# EAGLE design PARAMETRIK2L (EAGLE 7.4.0)
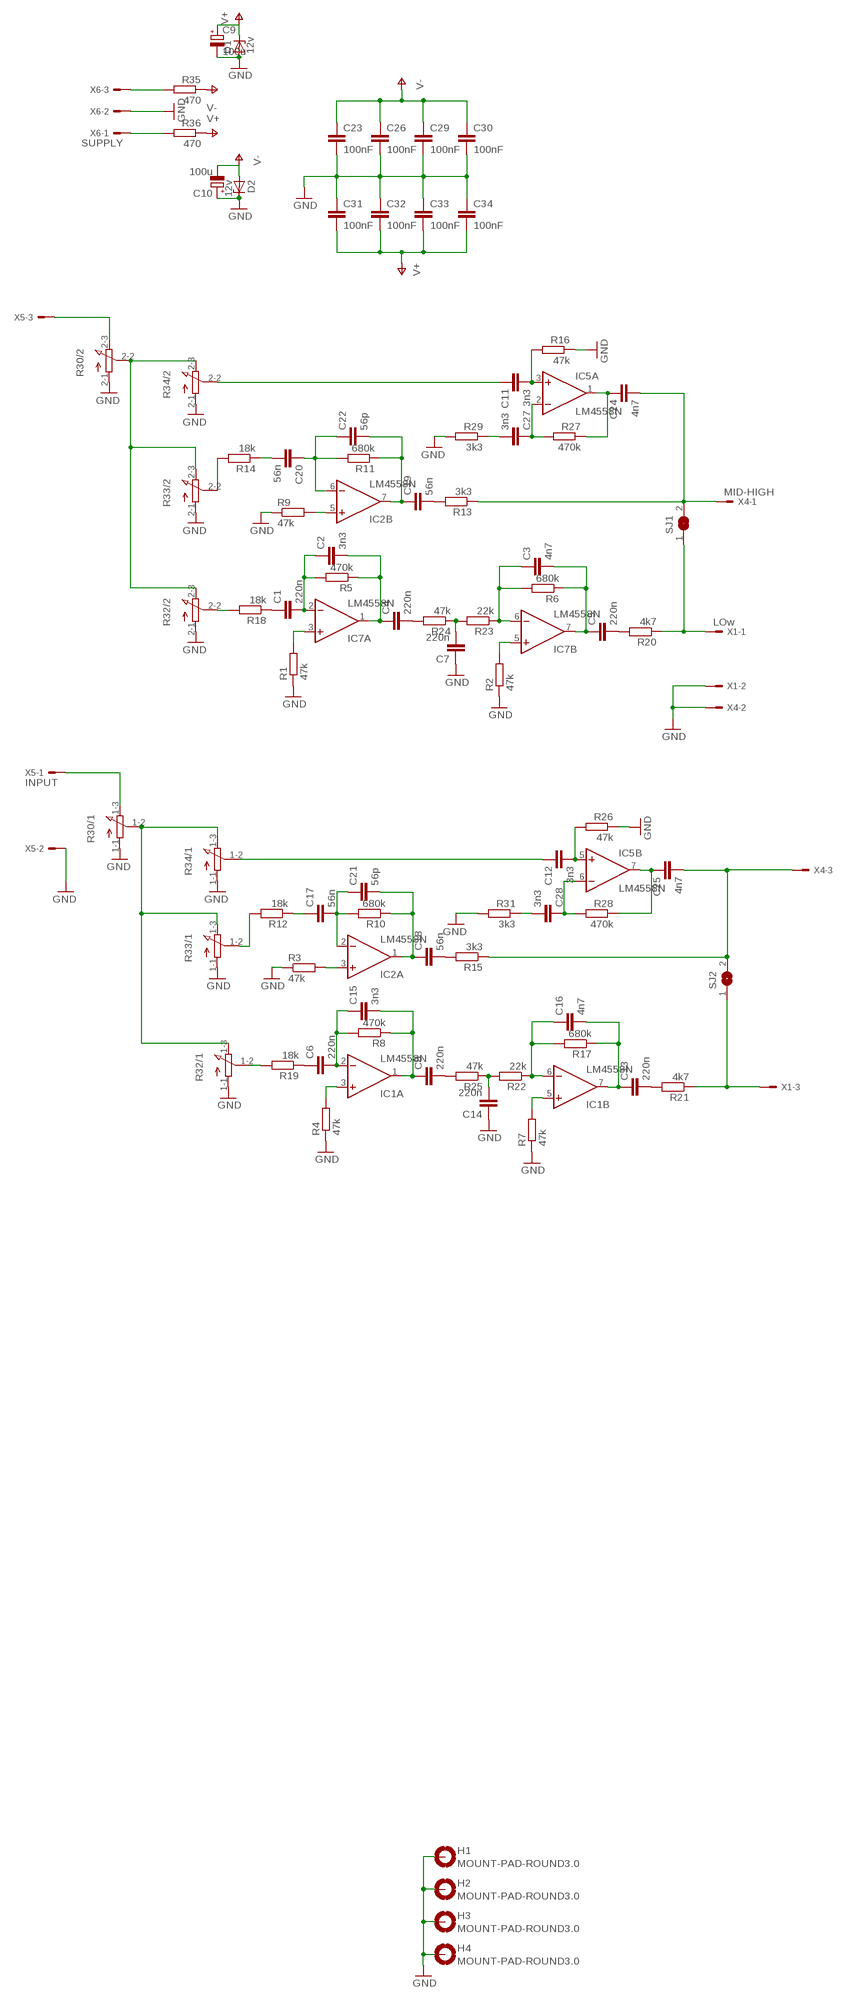
[diagram p0: schematic, sheet 1]

## Parts
C1  220n  C-EU050-030X075  [C050-030X075]
C2  3n3  C-EU025-024X044  [C025-024X044]
C3  4n7  C-EU025-024X044  [C025-024X044]
C4  220n  C-EU050-030X075  [C050-030X075]
C5  220n  C-EU050-030X075  [C050-030X075]
C6  220n  C-EU050-030X075  [C050-030X075]
C7  220n  C-EU050-030X075  [C050-030X075]
C8  220n  C-EU050-030X075  [C050-030X075]
C9  100u  CPOL-EUE2.5-6  [E2,5-6]
C10  100u  CPOL-EUE2.5-6  [E2,5-6]
C11  3n3  C-EU025-024X044  [C025-024X044]
C12  3n3  C-EU025-024X044  [C025-024X044]
C13  220n  C-EU050-030X075  [C050-030X075]
C14  220n  C-EU050-030X075  [C050-030X075]
C15  3n3  C-EU025-024X044  [C025-024X044]
C16  4n7  C-EU025-024X044  [C025-024X044]
C17  56n  C-EU050-030X075  [C050-030X075]
C18  56n  C-EU050-030X075  [C050-030X075]
C19  56n  C-EU050-030X075  [C050-030X075]
C20  56n  C-EU050-030X075  [C050-030X075]
C21  56p  C-EU025-024X044  [C025-024X044]
C22  56p  C-EU025-024X044  [C025-024X044]
C23  100nF  C-EU050-024X044  [C050-024X044]
C24  4n7  C-EU025-024X044  [C025-024X044]
C25  4n7  C-EU025-024X044  [C025-024X044]
C26  100nF  C-EU050-024X044  [C050-024X044]
C27  3n3  C-EU025-024X044  [C025-024X044]
C28  3n3  C-EU025-024X044  [C025-024X044]
C29  100nF  C-EU050-024X044  [C050-024X044]
C30  100nF  C-EU050-024X044  [C050-024X044]
C31  100nF  C-EU050-024X044  [C050-024X044]
C32  100nF  C-EU050-024X044  [C050-024X044]
C33  100nF  C-EU050-024X044  [C050-024X044]
C34  100nF  C-EU050-024X044  [C050-024X044]
D1  12v  1N821  [DO35Z10]
D2  12v  1N821  [DO35Z10]
H1  MOUNT-PAD-ROUND3.0  [3,0-PAD]
H2  MOUNT-PAD-ROUND3.0  [3,0-PAD]
H3  MOUNT-PAD-ROUND3.0  [3,0-PAD]
H4  MOUNT-PAD-ROUND3.0  [3,0-PAD]
IC1  LM4558N  [DIL08]
IC2  LM4558N  [DIL08]
IC5  LM4558N  [DIL08]
IC7  LM4558N  [DIL08]
R1  47k  R-EU_0207/2V  [0207/2V]
R2  47k  R-EU_0207/2V  [0207/2V]
R3  47k  R-EU_0207/2V  [0207/2V]
R4  47k  R-EU_0207/2V  [0207/2V]
R5  470k  R-EU_0207/2V  [0207/2V]
R6  680k  R-EU_0207/2V  [0207/2V]
R7  47k  R-EU_0207/2V  [0207/2V]
R8  470k  R-EU_0207/2V  [0207/2V]
R9  47k  R-EU_0207/2V  [0207/2V]
R10  680k  R-EU_0207/2V  [0207/2V]
R11  680k  R-EU_0207/2V  [0207/2V]
R12  18k  R-EU_0207/2V  [0207/2V]
R13  3k3  R-EU_0207/2V  [0207/2V]
R14  18k  R-EU_0207/2V  [0207/2V]
R15  3k3  R-EU_0207/2V  [0207/2V]
R16  47k  R-EU_0207/2V  [0207/2V]
R17  680k  R-EU_0207/2V  [0207/2V]
R18  18k  R-EU_0207/2V  [0207/2V]
R19  18k  R-EU_0207/2V  [0207/2V]
R20  4k7  R-EU_0207/2V  [0207/2V]
R21  4k7  R-EU_0207/2V  [0207/2V]
R22  22k  R-EU_0207/2V  [0207/2V]
R23  22k  R-EU_0207/2V  [0207/2V]
R24  47k  R-EU_0207/2V  [0207/2V]
R25  47k  R-EU_0207/2V  [0207/2V]
R26  47k  R-EU_0207/2V  [0207/2V]
R27  470k  R-EU_0207/2V  [0207/2V]
R28  470k  R-EU_0207/2V  [0207/2V]
R29  3k3  R-EU_0207/2V  [0207/2V]
R30  3RP/1610G  [3RP/1610G]
R31  3k3  R-EU_0207/2V  [0207/2V]
R32  3RP/1610G  [3RP/1610G]
R33  3RP/1610G  [3RP/1610G]
R34  3RP/1610G  [3RP/1610G]
R35  470  R-EU_0207/10  [0207/10]
R36  470  R-EU_0207/10  [0207/10]
SJ1  SJ  [SJ]
SJ2  SJ  [SJ]
X1  LOw  22-23-2031  [22-23-2031]
X4  MID-HIGH  22-23-2031  [22-23-2031]
X5  INPUT  22-23-2031  [22-23-2031]
X6  SUPPLY  22-23-2031  [22-23-2031]

## Nets
GND: C7.1 C9.- C10.+ C14.1 C23.2 C26.2 C29.2 C30.2 C31.1 C32.1 C33.1 C34.1 D1.A D2.C H1.B3,0(MOUNT) H2.B3,0(MOUNT) H3.B3,0(MOUNT) H4.B3,0(MOUNT) R1.1 R2.1 R3.1 R4.1 R7.1 R9.1 R16.1 R26.1 R29.2 R30.1-1(/1:A) R30.2-1(/2:A) R31.2 R32.1-1(/1:A) R32.2-1(/2:A) R33.1-1(/1:A) R33.2-1(/2:A) R34.1-1(/1:A) R34.2-1(/2:A) X1.2 X4.2 X5.2 X6.2
N$1: IC1.3(A:+IN) R4.2
N$2: IC1.5(B:+IN) R7.2
N$3: IC7.3(A:+IN) R1.2
N$4: IC7.5(B:+IN) R2.2
N$5: C1.2 C2.1 IC7.2(A:-IN) R5.2
N$6: C6.2 C15.1 IC1.2(A:-IN) R8.2
N$7: C8.1 C15.2 IC1.1(A:OUT) R8.1
N$8: C16.1 IC1.6(B:-IN) R17.2 R22.1
N$9: C13.1 C16.2 IC1.7(B:OUT) R17.1
N$10: C2.2 C4.1 IC7.1(A:OUT) R5.1
N$11: C3.1 IC7.6(B:-IN) R6.2 R23.1
N$12: C3.2 C5.1 IC7.7(B:OUT) R6.1
N$13: IC2.3(A:+IN) R3.2
N$14: IC2.5(B:+IN) R9.2
N$15: C17.2 C21.1 IC2.2(A:-IN) R10.2
N$16: C18.1 C21.2 IC2.1(A:OUT) R10.1
N$17: C20.1 C22.1 IC2.6(B:-IN) R11.2
N$18: C19.1 C22.2 IC2.7(B:OUT) R11.1
N$19: C17.1 R12.1
N$20: C19.2 R13.2
N$21: C18.2 R15.2
N$22: C28.2 R31.1
N$23: C20.2 R14.1
N$24: R12.2 R33.1-2(/1:S)
N$25: C6.1 R19.1
N$26: C1.1 R18.1
N$27: C13.2 R21.2
N$28: C5.2 R20.2
N$29: C24.2 R13.1 SJ1.2 X4.1
N$30: C11.2 IC5.3(A:+IN) R16.2
N$31: C8.2 R25.2
N$32: C14.2 R22.2 R25.1
N$33: C4.2 R24.2
N$34: C7.2 R23.2 R24.1
N$35: C12.2 IC5.5(B:+IN) R26.2
N$36: C27.1 IC5.2(A:-IN) R27.2
N$37: C24.1 IC5.1(A:OUT) R27.1
N$38: C28.1 IC5.6(B:-IN) R28.2
N$39: C25.1 IC5.7(B:OUT) R28.1
N$40: C27.2 R29.1
N$41: C25.2 R15.1 SJ2.2 X4.3
N$42: R14.2 R33.2-2(/2:S)
N$43: R19.2 R32.1-2(/1:S)
N$44: R18.2 R32.2-2(/2:S)
N$45: R30.2-2(/2:S) R32.2-3(/2:E) R33.2-3(/2:E) R34.2-3(/2:E)
N$46: R35.2 X6.3
N$47: R30.1-2(/1:S) R32.1-3(/1:E) R33.1-3(/1:E) R34.1-3(/1:E)
N$48: R36.2 X6.1
N$49: R30.1-3(/1:E) X5.1
N$50: R30.2-3(/2:E) X5.3
N$51: C11.1 R34.2-2(/2:S)
N$52: C12.1 R34.1-2(/1:S)
N$53: R21.1 SJ2.1 X1.3
N$54: R20.1 SJ1.1 X1.1
V+: C9.+ C31.2 C32.2 C33.2 C34.2 D1.C R36.1
V-: C10.- C23.1 C26.1 C29.1 C30.1 D2.A R35.1

## Power pins joined to a net without a drawn wire
V+: IC1.8(P:V+) IC2.8(P:V+) IC5.8(P:V+) IC7.8(P:V+)
V-: IC1.4(P:V-) IC2.4(P:V-) IC5.4(P:V-) IC7.4(P:V-)

## Library data of the parts
C1-C8 C11-C34 = rcl:C-EU: CAPACITOR, European symbol
C9 C10 = resistor:CPOL-EU: POLARIZED CAPACITOR, European symbol
D1 D2 = diode:1N821: Reference DIODE temperature compensated, 6,2 V
H1-H4 = holes:MOUNT-PAD-ROUND: MOUNTING PAD, round
IC1 IC2 IC5 IC7 = linear:*4558: OP AMP
R1-R29 R31 R35 R36 = resistor:R-EU_: RESISTOR, European symbol
R30 R32-R34 = pot:3RP/1610G: 16mm Potentiometer two level Source: http://www.alphapotentiometers.net/html/16mm_pot_2.html
SJ1 SJ2 = jumper:SJ: SMD solder JUMPER
X1 X4-X6 = con-molex:22-23-2031: .100" (2.54mm) Center Header - 3 Pin; MF: MOLEX; MPN: 22-23-2031; OC_FARNELL: 1462950; OC_NEWARK: 30C0862

## Board
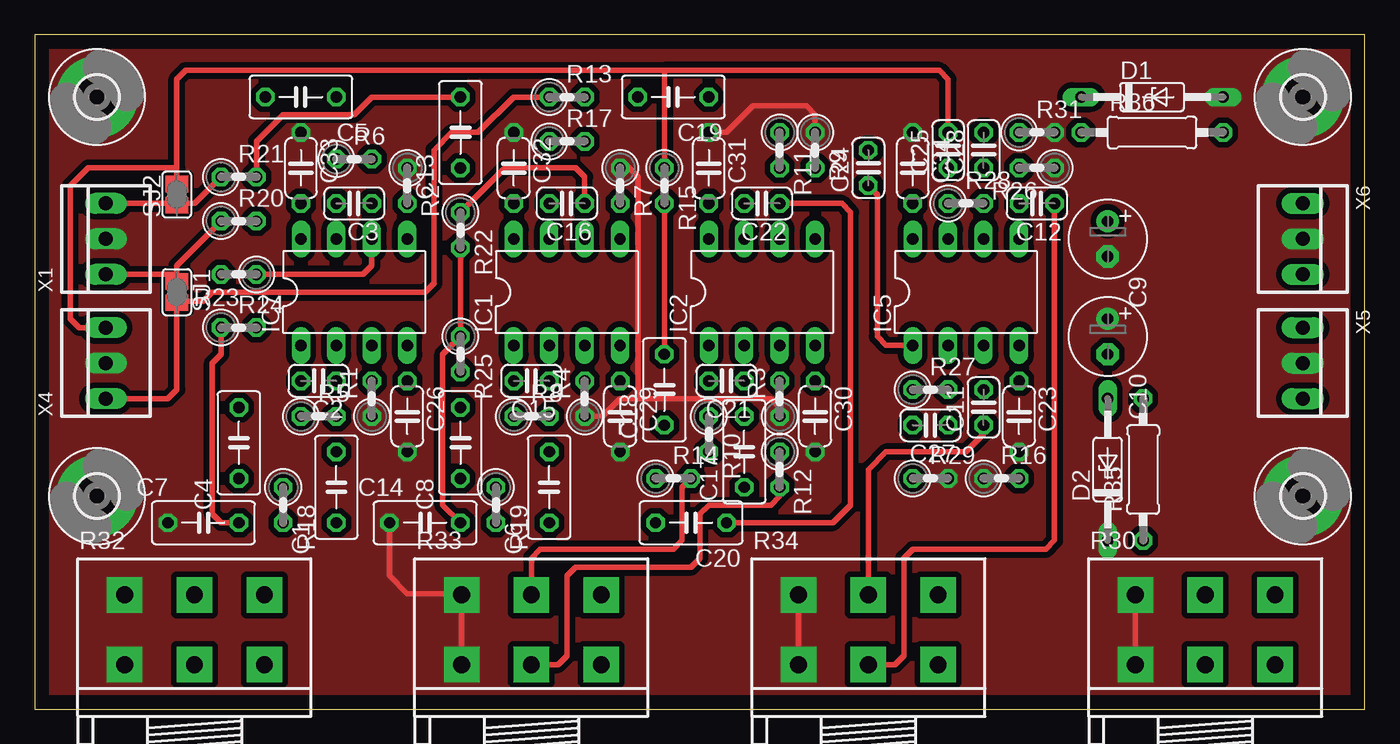
[diagram p1: board, top side]
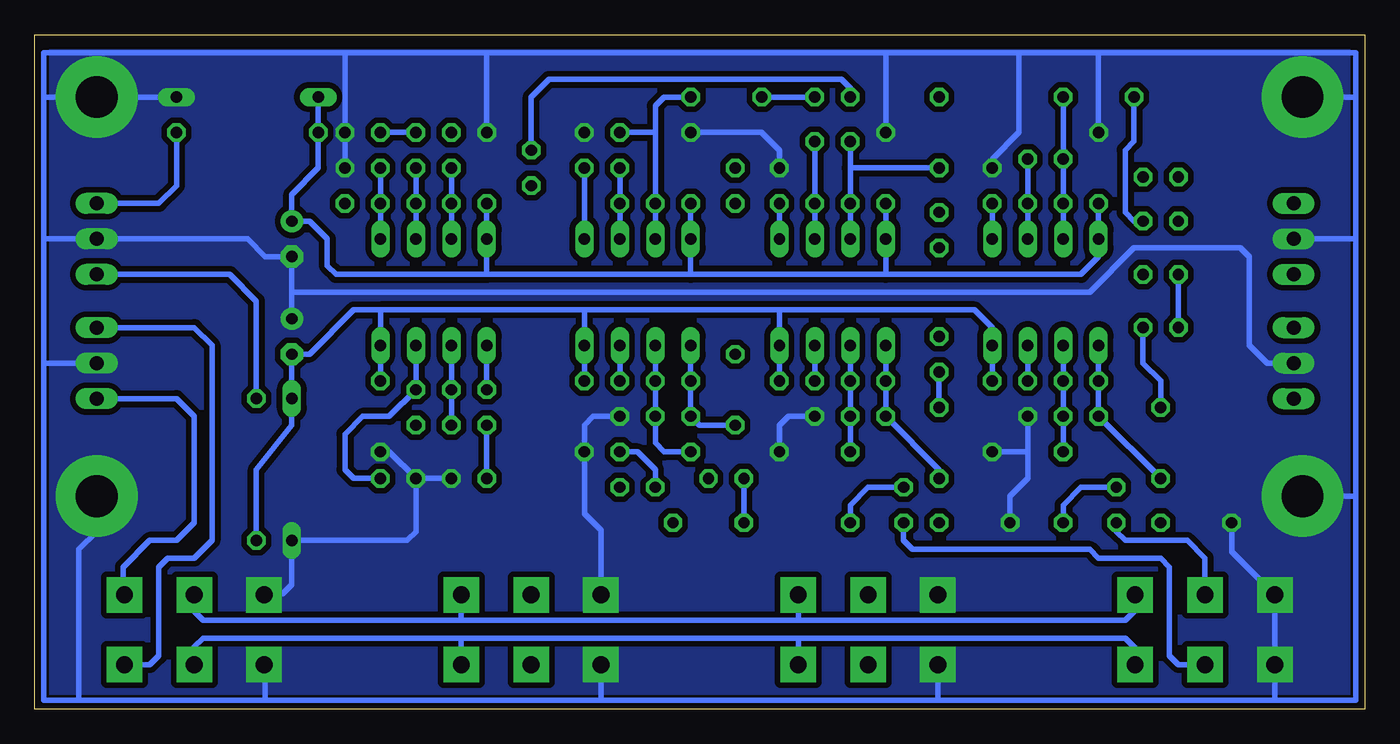
[diagram p2: board, bottom side, seen from below]

Size 95.23 x 48.26 mm. Coordinates in mm from the lower left corner, seen from the top.
Outline: 0,0 95.23,0 95.23,48.26 0,48.26 0,0
Copper layers (1*16): Top 0.035mm / dielectric 1.5mm / Bottom 0.035mm
Design rules "default": minimum track width 10mil, minimum drill 24mil, track to track 8mil, track to pad 8mil, pad to pad 8mil, via to via 8mil, smd to smd 8mil, copper to edge 40mil, drill to drill 8mil, minimum pad ring 10mil, minimum via ring 8mil, stop-mask expansion 4mil, vias tented up to drill 0mil, thermal gap 10mil

### Footprints (pad centres in the part's own frame; a part is rotated, then mirrored left to right if it is on the bottom)
C050-030X075 = drill 0.813 octagon: 1 -2.54,0; 2 2.54,0
C025-024X044 = drill 0.813 octagon: 1 -1.27,0; 2 1.27,0
E2,5-6 = drill 0.813 pad 1.6: + -1.27,0 | drill 0.813 pad 1.6 octagon: - 1.27,0
C050-024X044 = drill 0.813 octagon: 1 -2.54,0; 2 2.54,0
DO35Z10 = drill 0.813 long: A 5.08,0; C -5.08,0
3,0-PAD = drill 3 pad 5.842: B3,0 0,0
DIL08 = drill 0.813 pad 1.27 long: 1 -3.81,-3.81; 2 -1.27,-3.81; 3 1.27,-3.81; 4 3.81,-3.81; 5 3.81,3.81; 6 1.27,3.81; 7 -1.27,3.81; 8 -3.81,3.81
0207/2V = drill 0.813 octagon: 1 -1.27,0; 2 1.27,0
3RP/1610G = drill 1.2 pad 2.54 square: 1-1 -5,0; 1-2 0,0; 1-3 5,0; 2-1 -5,5; 2-2 0,5; 2-3 5,5
0207/10 = drill 0.813 octagon: 1 -5.08,0; 2 5.08,0
SJ = smd 1.168 x 1.6: 1 -0.762,0; 2 0.762,0
22-23-2031 = drill 1 long: 1 -2.54,0; 2 0,0; 3 2.54,0

### Placement (x,y rotation side)
C1  21.59,15.88 90 top
C2  20.32,23.5 180 top
C3  22.86,36.2 180 top
C4  14.61,19.05 90 top
C5  19.05,43.81 180 top
C6  36.83,15.88 90 top
C7  12.06,13.34 0 top
C8  30.48,19.05 90 top
C9  76.83,33.66 270 top
C10  76.83,26.67 270 top
C11  67.94,21.59 90 top
C12  71.75,36.2 180 top
C13  30.48,41.27 90 top
C14  27.94,13.34 0 top
C15  35.56,23.5 180 top
C16  38.1,36.2 180 top
C17  50.8,18.41 90 top
C18  45.09,22.86 90 top
C19  45.72,43.81 180 top
C20  46.99,13.34 180 top
C21  49.53,23.5 180 top
C22  52.07,36.2 180 top
C23  70.48,20.95 270 top
C24  59.69,38.73 90 top
C25  65.41,40.01 90 top
C26  26.67,20.95 270 top
C27  64.14,20.32 180 top
C28  67.94,40.01 90 top
C29  41.91,20.95 270 top
C30  55.88,20.95 270 top
C31  48.26,38.73 270 top
C32  34.29,38.73 270 top
C33  19.05,38.73 270 top
C34  62.87,38.73 270 top
D1  80.01,43.81 0 top
D2  76.83,17.14 90 top
H1  90.81,43.81 0 top
H2  4.45,43.81 0 top
H3  4.45,15.24 0 top
H4  90.81,15.24 0 top
IC1  38.1,29.84 0 top
IC2  52.07,29.84 0 top
IC5  66.67,29.84 0 top
IC7  22.86,29.84 0 top
R1  24.13,22.23 90 top
R2  26.67,37.47 270 top
R3  53.34,22.23 90 top
R4  39.37,22.23 90 top
R5  20.32,20.95 0 top
R6  22.86,39.37 0 top
R7  41.91,37.47 270 top
R8  35.56,20.95 0 top
R9  55.88,40.01 270 top
R10  48.26,19.68 270 top
R11  53.34,40.01 270 top
R12  53.34,17.14 270 top
R13  38.1,43.81 0 top
R14  45.72,16.51 0 top
R15  45.09,37.47 270 top
R16  69.22,16.51 0 top
R17  38.1,40.64 0 top
R18  17.78,14.61 270 top
R19  33.02,14.61 270 top
R20  14.61,34.92 0 top
R21  14.61,38.1 0 top
R22  30.48,34.29 270 top
R23  14.61,31.11 180 top
R24  14.61,27.3 0 top
R25  30.48,25.4 270 top
R26  71.75,38.73 180 top
R27  64.14,22.86 0 top
R28  66.67,36.2 0 top
R29  64.14,16.51 0 top
R30  83.82,3.17 0 top
R31  71.75,41.27 0 top
R32  11.43,3.17 0 top
R33  35.56,3.17 0 top
R34  59.69,3.17 0 top
R35  79.38,17.14 90 top
R36  80.01,41.27 0 top
SJ1  10.16,29.84 270 top
SJ2  10.16,36.83 90 top
X1  5.08,33.66 90 top
X4  5.08,24.77 90 top
X5  90.81,24.77 270 top
X6  90.81,33.66 270 top

### Tracks (layer width: path | path; a pad name or v marks a point on that pad's centre or on a via)
GND
  Top 0.406: R34.2-1 R34.1-1 | R30.2-1 R30.1-1 | C14.1 25.4,9.53 26.67,8.26 30.48,8.26 R33.2-1 R33.1-1 | R3.1 53.34,21.59 52.7,22.23 43.18,22.23 | 43.18,22.23 41.91,22.23 40.64,20.95 R4.1 | R9.1 55.88,42.55 55.24,43.18 51.44,43.18 49.53,41.27 C31.1 | R7.1 42.55,38.73 43.18,38.1 43.18,22.23
  Bottom 0.406: R26.1 R31.2 73.03,46.99 | C34.1 62.87,46.99 | 62.87,46.99 34.29,46.99 | 34.29,46.99 24.77,46.99 | 24.77,46.99 19.05,46.99 | 19.05,46.99 C33.1 | C32.1 34.29,46.99 | C26.2 24.13,18.41 | 24.13,18.41 R1.1 | R4.1 41.27,20.95 41.91,20.32 C29.2 | R3.1 55.24,20.95 55.88,20.32 C30.2 55.88,13.97 54.69,12.78 R34.2-1 | 73.03,46.99 62.87,46.99 | 19.05,46.99 0.64,46.99 0.64,43.81 | 76.83,29.84 C10.+ | C14.1 25.4,15.24 24.13,16.51 24.13,18.41 | R2.1 26.67,39.37 24.77,41.27 24.77,46.99 | R32.2-1 R32.1-1 6.43,0.71 6.35,0.64 | 6.35,0.64 30.48,0.64 | 30.48,0.64 54.61,0.64 | 54.61,0.64 78.74,0.64 | 78.74,0.64 78.74,3.1 R30.1-1 | R34.1-1 54.69,0.71 54.61,0.64 | R33.1-1 30.56,0.71 30.48,0.64 | X1.2 0.64,33.66 | R30.2-1 78.74,8.26 77.47,8.26 76.83,8.89 D2.C 68.58,12.06 67.94,12.7 R16.1 | 73.03,46.99 94.61,46.99 94.61,43.81 | D1.A H1.B3,0 94.61,43.81 | H4.B3,0 90.81,12.7 92.08,11.43 92.08,0.64 | 92.08,0.64 78.74,0.64 | 6.35,8.26 R32.2-1 | 0.64,43.81 0.64,33.66 | 0.64,33.66 0.64,15.24 | 0.64,15.24 0.64,0.64 6.35,0.64 | X4.2 6.99,24.77 8.26,26.04 8.26,32.38 8.89,33.02 16.51,33.02 19.68,29.84 76.83,29.84 | H2.B3,0 0.64,43.81 | X5.2 94.61,24.77 | 94.61,24.77 94.61,0.64 92.08,0.64 | 94.61,33.66 94.61,24.77 | 94.61,33.66 X6.2 80.01,33.66 78.74,32.38 C9.- 76.83,29.84 | C7.1 9.53,11.27 R32.2-1 | H3.B3,0 0.64,15.24 | 94.61,43.81 94.61,33.66 | C31.1 43.18,41.27 41.91,40.01 R7.1 | R16.1 R29.2 | C23.2 69.85,18.41 R16.1
  pour Bottom (isolate 0.406, no thermals): -0.64,48.9 95.89,48.9 96.52,-0.64 -0.64,-0.64
  pour Top (isolate 0.406, no thermals): -1.27,49.53 97.79,50.16 96.52,-1.27 -1.27,-1.27
N$1
  Bottom 0.406: IC1.3 R4.2
N$2
  Bottom 0.406: R7.2 IC1.5
N$3
  Bottom 0.406: IC7.3 R1.2
N$4
  Bottom 0.406: R2.2 IC7.5
N$5
  Bottom 0.406: IC7.2 C2.1 R5.2 C1.2
N$6
  Bottom 0.406: IC1.2 C15.1 R8.2 C6.2
N$7
  Bottom 0.406: IC1.1 C15.2 R8.1 30.48,17.14 C8.1
N$8
  Top 0.406: C16.1 39.37,38.1 38.73,38.73 33.66,38.73 R22.1
  Bottom 0.406: IC1.6 C16.1 R17.2
N$9
  Bottom 0.406: IC1.7 C16.2 36.83,38.73 | R17.1 36.83,38.73 | 36.83,38.73 C13.1
N$10
  Bottom 0.406: IC7.1 C2.2 R5.1 C4.1
N$11
  Top 0.406: IC7.6 24.13,31.75 23.5,31.11 R23.1
  Bottom 0.406: IC7.6 C3.1 R6.2
N$12
  Bottom 0.406: IC7.7 C3.2 R6.1 C5.1
N$13
  Bottom 0.406: R3.2 IC2.3
N$14
  Bottom 0.406: R9.2 IC2.5
N$15
  Bottom 0.406: IC2.2 C21.1 C17.2 50.8,19.05 50.16,18.41 R10.2
N$16
  Bottom 0.406: IC2.1 C21.2 R10.1 47.62,20.32 C18.1
N$17
  Top 0.406: C20.1 57.15,13.34 58.42,14.61 58.42,35.56 57.78,36.2 C22.1
  Bottom 0.406: IC2.6 C22.1 R11.2
N$18
  Bottom 0.406: IC2.7 C22.2 50.8,41.27 | C19.1 50.16,43.81 50.8,43.18 50.8,41.27 | R11.1 50.8,41.27
N$19
  Bottom 0.406: C17.1 50.8,17.14 52.07,18.41 R12.1
N$20
  Bottom 0.406: R13.2 C19.2
N$21
  Top 0.406: R15.2 C18.2
N$22
  Bottom 0.406: C28.2 R31.1
N$23
  Bottom 0.406: C20.2 R14.1
N$24
  Top 0.406: R33.1-2 37.47,3.17 38.1,3.81 38.1,9.53 38.73,10.16 46.99,10.16 47.62,10.79 47.62,13.97 48.26,14.61 52.7,14.61 53.34,15.24 R12.2
N$25
  Bottom 0.406: C6.1 36.83,14.61 35.56,15.88 R19.1
N$26
  Bottom 0.406: R18.1 20.32,15.88 21.59,14.61 C1.1
N$27
  Top 0.406: C13.2 24.13,43.81 22.86,42.55 17.78,42.55 15.88,40.64 R21.2
N$28
  Bottom 0.406: C5.2 16.51,40.64 17.14,40.01 17.14,35.56 16.51,34.92 R20.2
N$29
  Top 0.406: X4.1 9.53,22.23 10.16,22.86 SJ1.2 10.29,29.21 12.06,29.21 12.7,29.84 27.94,29.84 28.57,30.48 28.57,40.01 29.84,41.27 31.75,41.27 34.29,43.81 R13.1
  Bottom 0.406: C24.2 59.69,43.81 58.42,45.09 37.47,45.09 36.83,44.45 R13.1
N$30
  Bottom 0.406: IC5.3 C11.2 69.85,20.95 71.75,20.95 73.03,19.68 73.03,17.14 72.39,16.51 R16.2
N$31
  Bottom 0.406: R25.2 C8.2
N$32
  Top 0.406: R22.2 R25.1 29.21,25.4 29.21,14.61 C14.2
N$33
  Bottom 0.406: R24.2 15.88,24.77 14.61,23.5 C4.2
N$34
  Top 0.406: C7.2 13.34,13.34 12.7,13.97 12.7,24.77 13.34,25.4 R24.1
  Bottom 0.406: R23.2 R24.1
N$35
  Bottom 0.406: R26.2 C12.2 IC5.5
N$36
  Bottom 0.406: IC5.2 R27.2 C27.1
N$37
  Top 0.406: C24.1 60.33,36.83 60.33,26.67 60.96,26.04 IC5.1
  Bottom 0.406: R27.1 IC5.1
N$38
  Bottom 0.406: IC5.6 R28.2 C28.1
N$39
  Bottom 0.406: IC5.7 R28.1 C25.1
N$40
  Bottom 0.406: C27.2 R29.1
N$41
  Top 0.406: C25.2 65.41,45.09 64.77,45.72 45.09,45.72 | 45.09,45.72 R15.1 | SJ2.2 10.16,38.73 | 10.16,38.73 10.16,45.09 10.79,45.72 45.09,45.72 | X4.3 3.17,27.3 2.54,27.94 2.54,37.47 3.81,38.73 10.16,38.73
N$42
  Top 0.406: R33.2-2 35.56,10.79 36.2,11.43 45.72,11.43 46.35,12.06 46.35,15.88 R14.2
N$43
  Bottom 0.406: R19.2 33.02,12.06 32.38,11.43 19.68,11.43 19.05,10.79 14.61,10.79 13.97,10.16 13.97,3.81 13.34,3.17 R32.1-2
N$44
  Bottom 0.406: R18.2 17.78,12.7 17.14,12.06 12.7,12.06 11.43,10.79 R32.2-2
N$45
  Bottom 0.406: 40.64,6.35 17.14,6.35 16.43,7.07 R32.2-3 | 40.64,6.35 64.77,6.35 | 64.77,6.35 83.19,6.35 83.82,6.99 R30.2-2 | R34.2-3 64.69,6.43 64.77,6.35 | R33.2-3 40.56,6.43 40.64,6.35
N$46
  Bottom 0.406: R35.2 79.38,29.21 81.28,31.11 X6.3
N$47
  Bottom 0.406: 40.64,5.08 17.14,5.08 16.43,4.37 R32.1-3 | 40.64,5.08 64.77,5.08 | 64.77,5.08 83.19,5.08 83.82,4.45 R30.1-2 | R34.1-3 64.69,5 64.77,5.08 | R33.1-3 40.56,5 40.64,5.08
N$48
  Bottom 0.406: X6.1 86.36,36.2 85.09,37.47 R36.2
N$49
  Bottom 0.406: R30.1-3 87,3.17 86.36,3.81 86.36,10.16 85.72,10.79 83.82,10.79 82.55,12.06 82.55,26.04 83.82,27.3 X5.1
N$50
  Bottom 0.406: R30.2-3 88.9,8.26 88.9,10.16 87,12.06 85.09,12.06 83.82,13.34 83.82,20.95 85.09,22.23 X5.3
N$51
  Top 0.406: C11.1 67.94,19.68 66.67,18.41 60.96,18.41 59.69,17.14 R34.2-2
N$52
  Top 0.406: C12.1 73.03,12.06 72.39,11.43 62.87,11.43 62.23,10.79 62.23,3.81 61.59,3.17 R34.1-2
N$53
  Top 0.406: X1.3 10.03,36.2 SJ2.1 10.29,36.2 11.43,36.2 R21.1
N$54
  Top 0.406: R20.1 10.16,31.75 10.16,31.11 | 10.16,31.11 SJ1.1 | X1.1 10.16,31.11
V+
  Bottom 0.406: 34.29,31.11 20.32,31.11 19.05,32.38 IC7.8 C33.2 | 34.29,31.11 48.26,31.11 | 48.26,31.11 62.87,31.11 | 62.87,31.11 IC5.8 C34.2 | 48.26,31.11 IC2.8 C31.2 | 34.29,31.11 IC1.8 C32.2 | 62.87,31.11 73.66,31.11 74.3,31.75 74.3,33.66 75.56,34.92 C9.+ 76.83,36.83 74.93,38.73 R36.1 D1.C
V-
  Bottom 0.406: 41.91,28.57 27.94,28.57 26.67,27.3 IC7.4 C26.1 | 41.91,28.57 55.88,28.57 | 55.88,28.57 70.48,28.57 | 70.48,28.57 IC5.4 C23.1 | 55.88,28.57 IC2.4 C30.1 | 41.91,28.57 IC1.4 C29.1 | 70.48,28.57 72.39,28.57 75.56,25.4 C10.- D2.A 76.83,20.32 79.38,17.14 R35.1